# Altium schematic sheet Napajanje.SchDoc
size A4
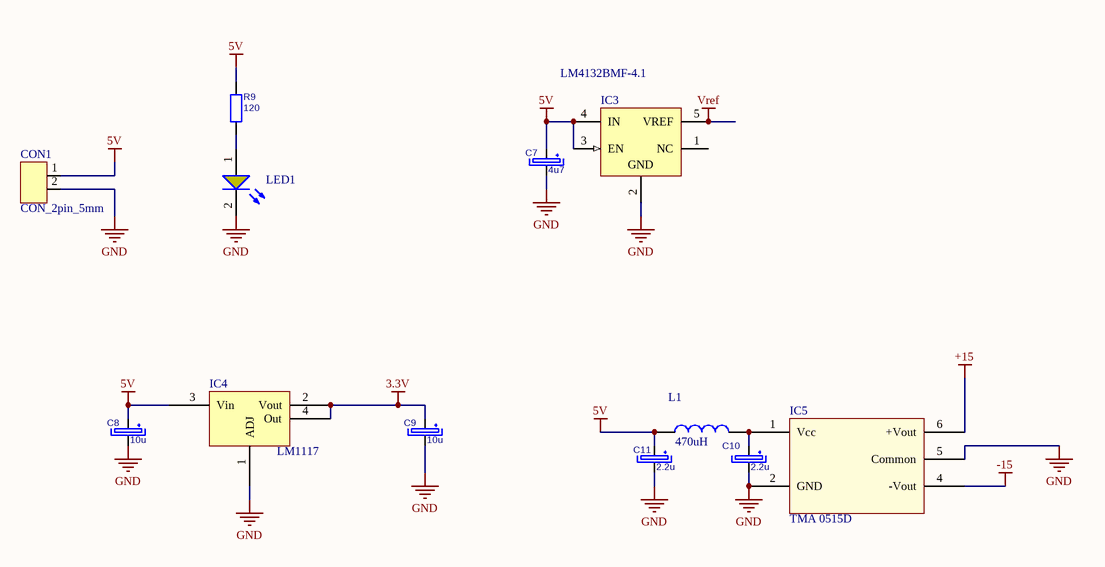
[diagram p0: Napajanje.SchDoc]

## Parts
C7  4u7  [C Tantal A]
C8  10u  [C Tantal B]
C9  10u  [C Tantal B]
C10  2.2u  [C Tantal B]
C11  2.2u  [C Tantal B]
CON1  CON_2pin_5mm  [CON_2pin_5mm]
IC3  LM4132BMF-4.1  [SOT95P280X145-5N]
IC4  LM1117  [SOT230P700X180-4N]
IC5  TMA 0515D  [TMA 0515D]
L1  value 470uH  [WE-PD2_7850]  (hidden comment: WE-PD2, 74477530)
LED1  150060YS75000  [LED_0603_Yellow]  (value not drawn)
R9  120  [R0805]

## Nets
3.3V: C9.1 IC4.2(Vout) IC4.4(Out)
5V: C7.1 C8.1 C11.1 CON1.1 IC3.3(EN) IC3.4(IN) IC4.3(Vin) L1.1 R9.1
+15: IC5.6(+Vout)
-15: IC5.4(-Vout)
GND: C7.2 C8.2 C9.2 C10.2 C11.2 CON1.2 IC3.2(GND) IC4.1(ADJ) IC5.2(GND) IC5.5(Common) LED1.2(C)
Vref: IC3.5(VREF)
NetC10_1: C10.1 IC5.1(Vcc) L1.2
NetLED1_1: LED1.1(A) R9.2

Not connected (* = marked no-connect by the designer): IC3 1(NC)

## Notes on the sheet
- Title
- Size:
- Date:
- A4
- Number:
- Time:
- Revision:
- Sheet
- of
- File:

## Library data of the parts
C7-C11 = C+: Capacitor Polarized
  C7: Value: 4u7
  C8 C9: Value: 10u
  C10 C11: Value: 2.2u
CON1 = CON_2pin_5mm: Konektor za  Bernic ohišja Serija 605, 5 mm raster; Supplier 1: Farnell; Supplier Part Number 1: 1792766
IC3 = LM4132BMF-4.1: Precision Low Dropout Voltage Reference, 5-pin SOT-23; Manufacturer: National Semiconductor; PackageTopMarking: R4FB*XTT; PowerWise: Y; CompType: Voltage Reference IC; DatasheetVersion: Aug-2006; PackageVersion: revD, Aug-2008; PackageReference: MF05A; PackageDescription: Molded SOT-23, .115 x .063 x .040 in Body, 5 Lead, .0375 in Pitch; PartNumber: LM4132BMF-4.1; RoHS: N; PinCount: 5; ComponentLink1Description: Manufacturer URL; ComponentLink1URL: http://www.national.com/; ComponentLink2Description: LM4132 Datasheet; ComponentLink2URL: http://www.national.com/ds/LM/LM4132.pdf; ComponentLink3Description: LM4132 Web Page; ComponentLink3URL: http://www.national.com/pf/LM/LM4132.html; ComponentLink4Description: MF05A Package Page; ComponentLink4URL: http://www.national.com/packaging/folders/mf05a.html; Supplier 1: Farnell; Supplier Part Number 1: 1559272
L1 = WE-PD2, 74477530: WE-PD2 SMD Power Inductor, size 7850, 1000uH; Size: 7850; Supplier 1: Farnell; Supplier Part Number 1: 2062739
LED1 = WL-SMCW 0603  150060YS75000: SMD mono-color Chip LED, WL-SMCW, Yellow; Manufacturer: W黵th Elektronik eiSos GmbH; PartNo: 150060YS75000; ComponentLink1Description: Manufacturer; ComponentLink1URL: http://www.we-online.de; Created by: Christin Otto; Created Date: June 2013; ComponentLink2Description: Datasheet; ComponentLink2URL: http://katalog.we-online.com/led/datasheet/150060YS75000.pdf; Color: Yellow; Supplier 1: Farnell; Supplier Part Number 1: 2322074
R9 = R: Value: 120; Supplier 1: Farnell; Supplier Part Number 1: 9332596
IC4 = LM1117: Supplier 1: Farnell; Supplier Part Number 1: 1469051
IC5 = TMA 0515D: Supplier 1: Farnell; Supplier Part Number 1: 1007516